# EAGLE design Main_Board (EAGLE 6.3)

## Sheet 1 of 3
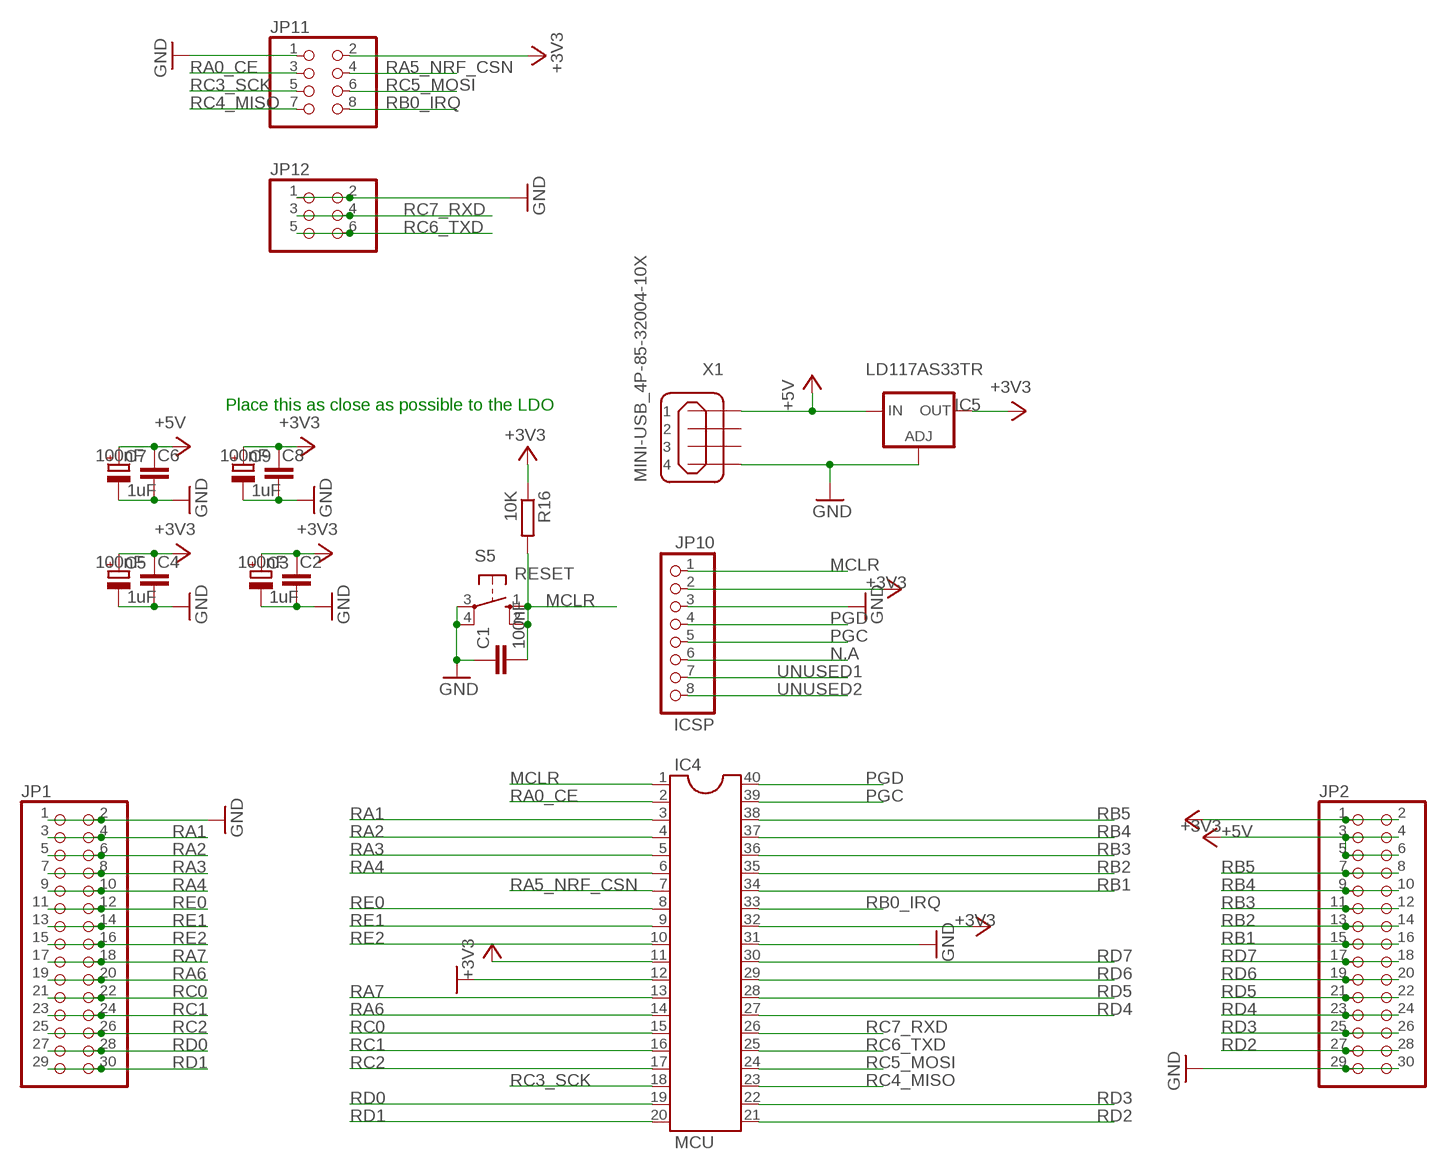
[diagram p0: schematic, sheet 1]

### Parts
C1  100nF  C-EU025-025X050  [C025-025X050]
C2  100nF  C-EU025-025X050  [C025-025X050]
C3  1uF  CPOL-EUE1.8-4  [E1,8-4]
C4  100nF  C-EU025-025X050  [C025-025X050]
C5  1uF  CPOL-EUE1.8-4  [E1,8-4]
C6  100nF  C-EU025-025X050  [C025-025X050]
C7  1uF  CPOL-EUE1.8-4  [E1,8-4]
C8  100nF  C-EU025-025X050  [C025-025X050]
C9  1uF  CPOL-EUE1.8-4  [E1,8-4]
IC4  MCU  DIL40  [DIL40]
IC5  LD117AS33TR  [SOT223]
JP1  PINHD-2X15  [2X15]
JP2  PINHD-2X15  [2X15]
JP10  ICSP  PINHD-1X8  [1X08]
JP11  PINHD-2X4  [2X04]
JP12  PINHD-2X3  [2X03]
R16  10K  R-EU_0207/10  [0207/10]
S5  RESET  10-XX  [B3F-10XX]
X1  MINI-USB_4P-85-32004-10X  [85-32004-10X]

### Nets
+3V3: C2.2 C3.+ C4.2 C5.+ C8.2 C9.+ IC4.11 IC4.32 IC5.4(OUT) JP2.1 JP2.2 JP10.2 JP11.2 R16.1 ; also sheet 2
+5V: C6.2 C7.+ IC5.3(IN) JP2.3 JP2.4 JP2.5 JP2.6 X1.1 ; also sheet 2
GND: C1.1 C2.1 C3.- C4.1 C5.- C6.1 C7.- C8.1 C9.- IC4.12 IC4.31 IC5.1(ADJ) JP1.1 JP1.2 JP2.29 JP2.30 JP10.3 JP11.1 JP12.1 JP12.2 S5.3(P) S5.4(P1) X1.4 ; also sheet 2,3
MCLR: C1.2 IC4.1 JP10.1 R16.2 S5.1(S) S5.2(S1)
N.A: JP10.6
PGC: IC4.39 JP10.5
PGD: IC4.40 JP10.4
RA0_CE: IC4.2 JP11.3
RA1: IC4.3 JP1.3 JP1.4
RA2: IC4.4 JP1.5 JP1.6
RA3: IC4.5 JP1.7 JP1.8
RA4: IC4.6 JP1.9 JP1.10
RA5_NRF_CSN: IC4.7 JP11.4
RA6: IC4.14 JP1.19 JP1.20
RA7: IC4.13 JP1.17 JP1.18
RB0_IRQ: IC4.33 JP11.8
RB1: IC4.34 JP2.15 JP2.16
RB2: IC4.35 JP2.13 JP2.14
RB3: IC4.36 JP2.11 JP2.12
RB4: IC4.37 JP2.9 JP2.10
RB5: IC4.38 JP2.7 JP2.8
RC0: IC4.15 JP1.21 JP1.22
RC1: IC4.16 JP1.23 JP1.24
RC2: IC4.17 JP1.25 JP1.26
RC3_SCK: IC4.18 JP11.5
RC4_MISO: IC4.23 JP11.7
RC5_MOSI: IC4.24 JP11.6
RC6_TXD: IC4.25 JP12.5 JP12.6
RC7_RXD: IC4.26 JP12.3 JP12.4
RD0: IC4.19 JP1.27 JP1.28
RD1: IC4.20 JP1.29 JP1.30
RD2: IC4.21 JP2.27 JP2.28
RD3: IC4.22 JP2.25 JP2.26
RD4: IC4.27 JP2.23 JP2.24
RD5: IC4.28 JP2.21 JP2.22
RD6: IC4.29 JP2.19 JP2.20
RD7: IC4.30 JP2.17 JP2.18
RE0: IC4.8 JP1.11 JP1.12
RE1: IC4.9 JP1.13 JP1.14
RE2: IC4.10 JP1.15 JP1.16
UNUSED1: JP10.7
UNUSED2: JP10.8
Unconnected: X1.2 X1.3

### Notes on the sheet
- Place this as close as possible to the LDO

## Sheet 2 of 3
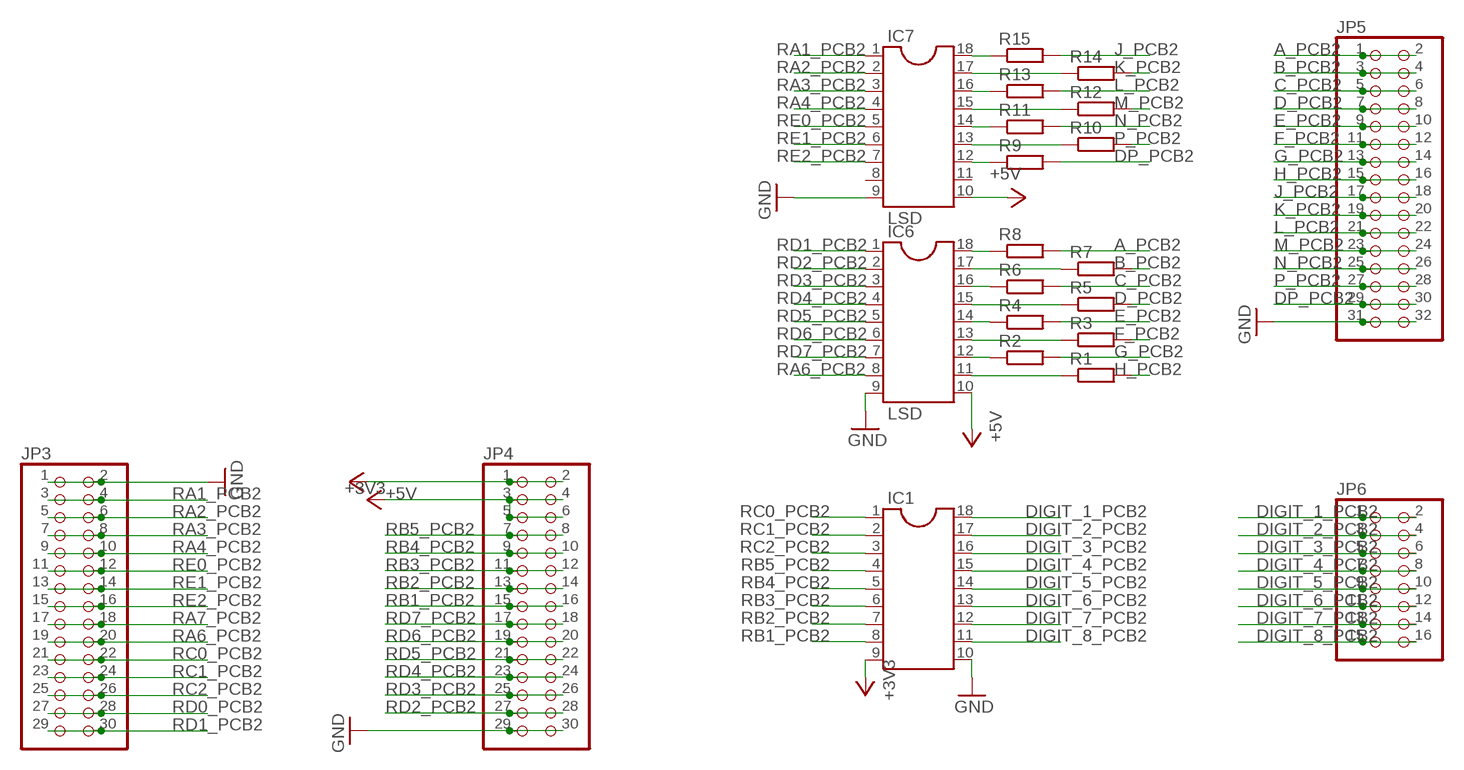
[diagram p1: schematic, sheet 2]

### Parts
IC1  DIL18  [DIL18]
IC6  LSD  DIL18  [DIL18]
IC7  LSD  DIL18  [DIL18]
JP3  PINHD-2X15  [2X15]
JP4  PINHD-2X15  [2X15]
JP5  PINHD-2X16  [2X16]
JP6  PINHD-2X8  [2X08]
R1  R-EU_R0805  [R0805]
R2  R-EU_R0805  [R0805]
R3  R-EU_R0805  [R0805]
R4  R-EU_R0805  [R0805]
R5  R-EU_R0805  [R0805]
R6  R-EU_R0805  [R0805]
R7  R-EU_R0805  [R0805]
R8  R-EU_R0805  [R0805]
R9  R-EU_R0805  [R0805]
R10  R-EU_R0805  [R0805]
R11  R-EU_R0805  [R0805]
R12  R-EU_R0805  [R0805]
R13  R-EU_R0805  [R0805]
R14  R-EU_R0805  [R0805]
R15  R-EU_R0805  [R0805]

### Nets
+3V3: IC1.9 JP4.1 JP4.2 ; also sheet 1
+5V: IC6.10 IC7.10 JP4.3 JP4.4 JP4.5 JP4.6 ; also sheet 1
A_PCB2: JP5.1 JP5.2 R8.2
B_PCB2: JP5.3 JP5.4 R7.2
C_PCB2: JP5.5 JP5.6 R6.2
D_PCB2: JP5.7 JP5.8 R5.2
DIGIT_1_PCB2: IC1.18 JP6.1 JP6.2
DIGIT_2_PCB2: IC1.17 JP6.3 JP6.4
DIGIT_3_PCB2: IC1.16 JP6.5 JP6.6
DIGIT_4_PCB2: IC1.15 JP6.7 JP6.8
DIGIT_5_PCB2: IC1.14 JP6.9 JP6.10
DIGIT_6_PCB2: IC1.13 JP6.11 JP6.12
DIGIT_7_PCB2: IC1.12 JP6.13 JP6.14
DIGIT_8_PCB2: IC1.11 JP6.15 JP6.16
DP_PCB2: JP5.29 JP5.30 R9.2
E_PCB2: JP5.9 JP5.10 R4.2
F_PCB2: JP5.11 JP5.12 R3.2
G_PCB2: JP5.13 JP5.14 R2.2
GND: IC1.10 IC6.9 IC7.9 JP3.1 JP3.2 JP4.29 JP4.30 JP5.31 JP5.32 ; also sheet 1,3
H_PCB2: JP5.15 JP5.16 R1.2
J_PCB2: JP5.17 JP5.18 R15.2
K_PCB2: JP5.19 JP5.20 R14.2
L_PCB2: JP5.21 JP5.22 R13.2
M_PCB2: JP5.23 JP5.24 R12.2
N$16: IC6.18 R8.1
N$17: IC6.17 R7.1
N$18: IC6.16 R6.1
N$19: IC6.15 R5.1
N$20: IC6.14 R4.1
N$21: IC6.13 R3.1
N$22: IC6.12 R2.1
N$23: IC6.11 R1.1
N$24: IC7.18 R15.1
N$25: IC7.17 R14.1
N$26: IC7.16 R13.1
N$27: IC7.15 R12.1
N$28: IC7.14 R11.1
N$29: IC7.13 R10.1
N$30: IC7.12 R9.1
N_PCB2: JP5.25 JP5.26 R11.2
P_PCB2: JP5.27 JP5.28 R10.2
RA1_PCB2: IC7.1 JP3.3 JP3.4
RA2_PCB2: IC7.2 JP3.5 JP3.6
RA3_PCB2: IC7.3 JP3.7 JP3.8
RA4_PCB2: IC7.4 JP3.9 JP3.10
RA6_PCB2: IC6.8 JP3.19 JP3.20
RA7_PCB2: JP3.17 JP3.18
RB1_PCB2: IC1.8 JP4.15 JP4.16
RB2_PCB2: IC1.7 JP4.13 JP4.14
RB3_PCB2: IC1.6 JP4.11 JP4.12
RB4_PCB2: IC1.5 JP4.9 JP4.10
RB5_PCB2: IC1.4 JP4.7 JP4.8
RC0_PCB2: IC1.1 JP3.21 JP3.22
RC1_PCB2: IC1.2 JP3.23 JP3.24
RC2_PCB2: IC1.3 JP3.25 JP3.26
RD0_PCB2: JP3.27 JP3.28
RD1_PCB2: IC6.1 JP3.29 JP3.30
RD2_PCB2: IC6.2 JP4.27 JP4.28
RD3_PCB2: IC6.3 JP4.25 JP4.26
RD4_PCB2: IC6.4 JP4.23 JP4.24
RD5_PCB2: IC6.5 JP4.21 JP4.22
RD6_PCB2: IC6.6 JP4.19 JP4.20
RD7_PCB2: IC6.7 JP4.17 JP4.18
RE0_PCB2: IC7.5 JP3.11 JP3.12
RE1_PCB2: IC7.6 JP3.13 JP3.14
RE2_PCB2: IC7.7 JP3.15 JP3.16
Unconnected: IC7.8 IC7.11

## Sheet 3 of 3
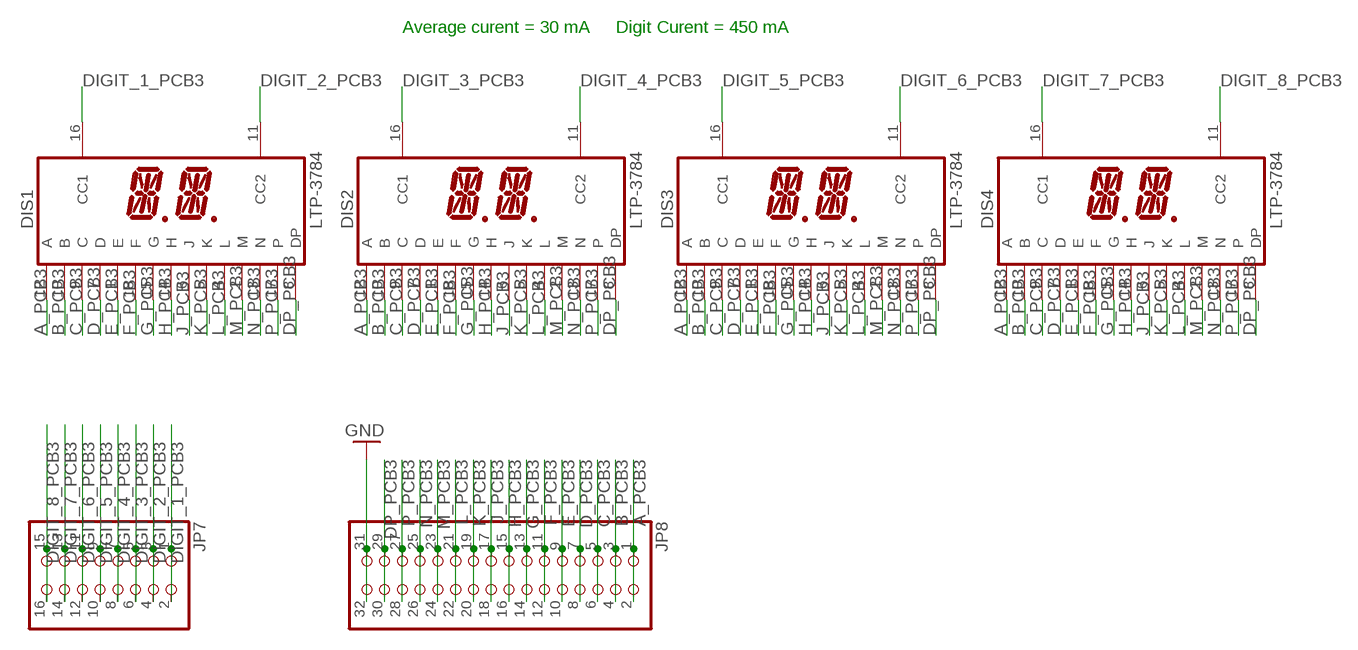
[diagram p2: schematic, sheet 3]

### Parts
DIS1  LTP-3784  [LTP-3784]
DIS2  LTP-3784  [LTP-3784]
DIS3  LTP-3784  [LTP-3784]
DIS4  LTP-3784  [LTP-3784]
JP7  PINHD-2X8  [2X08]
JP8  PINHD-2X16  [2X16]

### Nets
A_PCB3: DIS1.12(A) DIS2.12(A) DIS3.12(A) DIS4.12(A) JP8.1 JP8.2
B_PCB3: DIS1.10(B) DIS2.10(B) DIS3.10(B) DIS4.10(B) JP8.3 JP8.4
C_PCB3: DIS1.9(C) DIS2.9(C) DIS3.9(C) DIS4.9(C) JP8.5 JP8.6
D_PCB3: DIS1.7(D) DIS2.7(D) DIS3.7(D) DIS4.7(D) JP8.7 JP8.8
DIGIT_1_PCB3: DIS1.16(CC1) JP7.1 JP7.2
DIGIT_2_PCB3: DIS1.11(CC2) JP7.3 JP7.4
DIGIT_3_PCB3: DIS2.16(CC1) JP7.5 JP7.6
DIGIT_4_PCB3: DIS2.11(CC2) JP7.7 JP7.8
DIGIT_5_PCB3: DIS3.16(CC1) JP7.9 JP7.10
DIGIT_6_PCB3: DIS3.11(CC2) JP7.11 JP7.12
DIGIT_7_PCB3: DIS4.16(CC1) JP7.13 JP7.14
DIGIT_8_PCB3: DIS4.11(CC2) JP7.15 JP7.16
DP_PCB3: DIS1.8(DP) DIS2.8(DP) DIS3.8(DP) DIS4.8(DP) JP8.29 JP8.30
E_PCB3: DIS1.1(E) DIS2.1(E) DIS3.1(E) DIS4.1(E) JP8.9 JP8.10
F_PCB3: DIS1.18(F) DIS2.18(F) DIS3.18(F) DIS4.18(F) JP8.11 JP8.12
G_PCB3: DIS1.15(G) DIS2.15(G) DIS3.15(G) DIS4.15(G) JP8.13 JP8.14
GND: JP8.31 JP8.32 ; also sheet 1,2
H_PCB3: DIS1.14(H) DIS2.14(H) DIS3.14(H) DIS4.14(H) JP8.15 JP8.16
J_PCB3: DIS1.6(J) DIS2.6(J) DIS3.6(J) DIS4.6(J) JP8.17 JP8.18
K_PCB3: DIS1.5(K) DIS2.5(K) DIS3.5(K) DIS4.5(K) JP8.19 JP8.20
L_PCB3: DIS1.4(L) DIS2.4(L) DIS3.4(L) DIS4.4(L) JP8.21 JP8.22
M_PCB3: DIS1.2(M) DIS2.2(M) DIS3.2(M) DIS4.2(M) JP8.23 JP8.24
N_PCB3: DIS1.13(N) DIS2.13(N) DIS3.13(N) DIS4.13(N) JP8.25 JP8.26
P_PCB3: DIS1.17(P) DIS2.17(P) DIS3.17(P) DIS4.17(P) JP8.27 JP8.28

### Notes on the sheet
- Average curent = 30 mA | Digit Curent = 450 mA

## Library data of the parts
C1 C2 C4 C6 C8 = rcl:C-EU: CAPACITOR, European symbol; SPICEPREFIX: C
C3 C5 C7 C9 = rcl:CPOL-EU: POLARIZED CAPACITOR, European symbol; SPICEPREFIX: C
DIS1-DIS4 = liteon:LTP-3784
IC1 IC6 IC7 = ic-package:DIL18: Dual In Line / Socket
IC4 = ic-package:DIL40: Dual In Line
IC5 = v-reg:LD117A?*: Low drop fixed and adjustable positive voltage regulators 1 A Source: http://www.st.com/stonline/products/literature/ds/7194/ld1117axx.pdf
JP1-JP4 = pinhead:PINHD-2X15: PIN HEADER
JP5 JP8 = pinhead:PINHD-2X16: PIN HEADER
JP6 JP7 = pinhead:PINHD-2X8: PIN HEADER
JP10 = pinhead:PINHD-1X8: PIN HEADER
JP11 = pinhead:PINHD-2X4: PIN HEADER
JP12 = pinhead:PINHD-2X3: PIN HEADER
R1-R16 = rcl:R-EU_: RESISTOR, European symbol
S5 = switch-omron:10-XX: OMRON SWITCH; MPN: B3F-1000; OC_FARNELL: 176432; OC_NEWARK: 36M3542
X1 = con-cypressindustries:MINI-USB_4P-: MINI USB 4 Pol. Source: www.cypressindustries.com; OC_FARNELL: unknown; OC_NEWARK: unknown

## Board
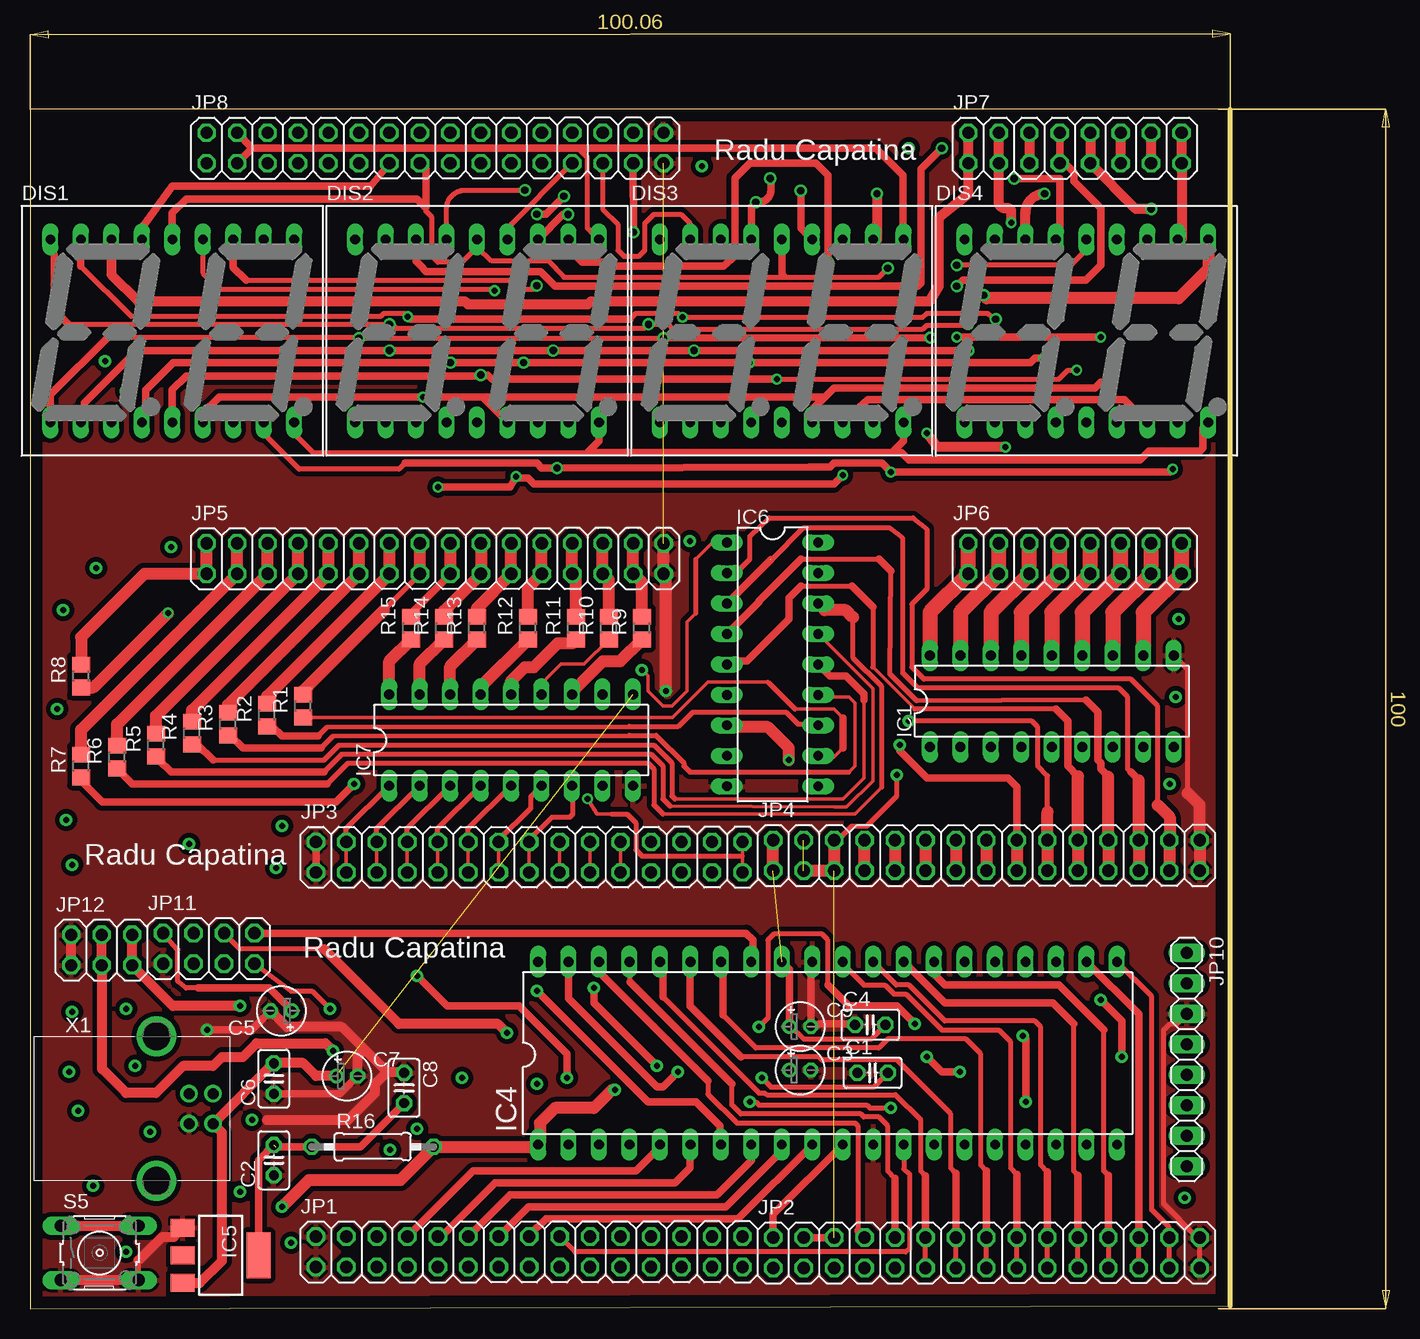
[diagram p3: board, top side]
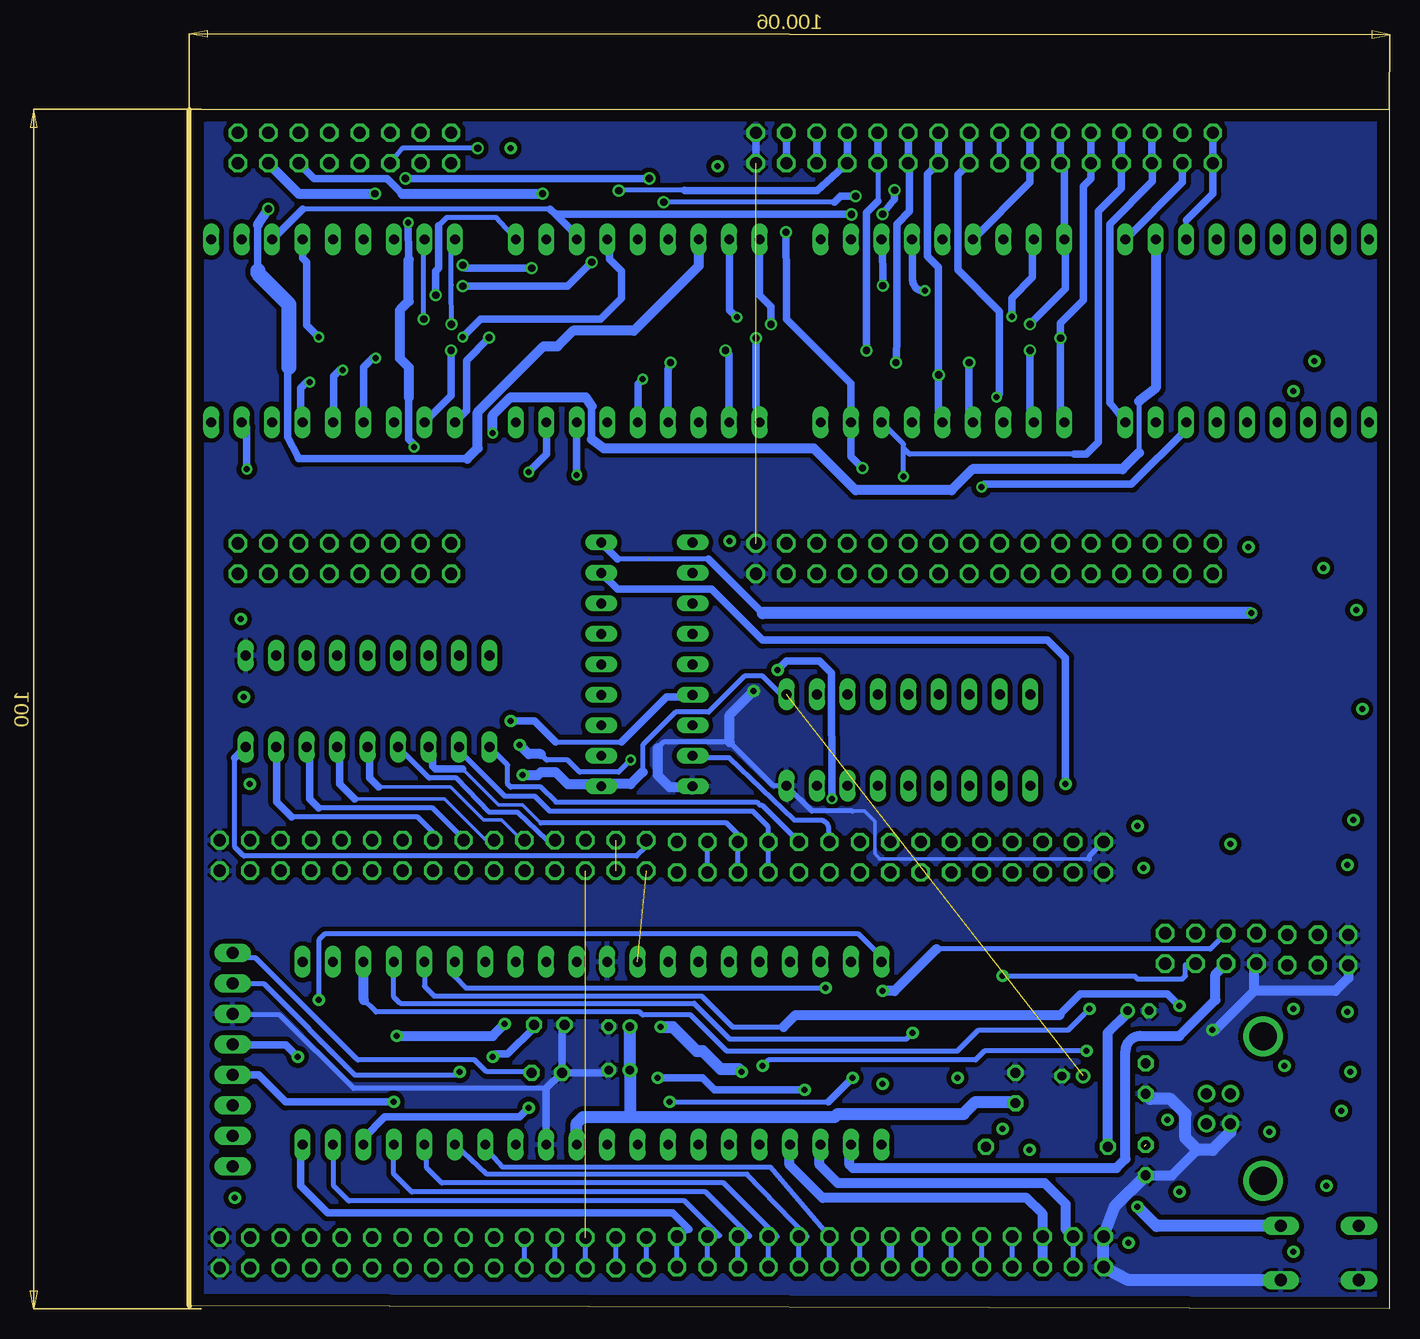
[diagram p4: board, bottom side, seen from below]

Size 100.04 x 100 mm. Coordinates in mm from the lower left corner, seen from the top.
Outline: 0,0 100.04,0.25 100.04,100 0,100 0,0
Copper layers (1*16): Top 0.035mm / dielectric 1.5mm / Bottom 0.035mm
Design rules "default *": minimum track width 10mil, minimum drill 0.24mm, track to track 0.2mm, track to pad 0.2mm, pad to pad 0.2mm, via to via 0.2mm, smd to smd 0.2mm, copper to edge 40mil, drill to drill 8mil, minimum pad ring 10mil, minimum via ring 8mil, stop-mask expansion 4mil, vias tented up to drill 0mil, thermal gap 10mil

### Footprints (pad centres in the part's own frame; a part is rotated, then mirrored left to right if it is on the bottom)
C025-025X050 = drill 0.813 octagon: 1 -1.27,0; 2 1.27,0
E1,8-4 = drill 0.711 pad 1.168: + -0.889,0 | drill 0.711 pad 1.168 octagon: - 0.889,0
LTP-3784 = drill 0.813 long: 1 -10.16,-7.62; 2 -7.62,-7.62; 3 -5.08,-7.62; 4 -2.54,-7.62; 5 0,-7.62; 6 2.54,-7.62; 7 5.08,-7.62; 8 7.62,-7.62; 9 10.16,-7.62; 10 10.16,7.62; 11 7.62,7.62; 12 5.08,7.62; 13 2.54,7.62; 14 0,7.62; 15 -2.54,7.62; 16 -5.08,7.62; 17 -7.62,7.62; 18 -10.16,7.62
DIL18 = drill 0.813 long: 1 -10.16,-3.81; 2 -7.62,-3.81; 3 -5.08,-3.81; 4 -2.54,-3.81; 5 0,-3.81; 6 2.54,-3.81; 7 5.08,-3.81; 8 7.62,-3.81; 9 10.16,-3.81; 10 10.16,3.81; 11 7.62,3.81; 12 5.08,3.81; 13 2.54,3.81; 14 0,3.81; 15 -2.54,3.81; 16 -5.08,3.81; 17 -7.62,3.81; 18 -10.16,3.81
DIL40 = drill 0.813 long: 1 -24.13,-7.62; 2 -21.59,-7.62; 3 -19.05,-7.62; 4 -16.51,-7.62; 5 -13.97,-7.62; 6 -11.43,-7.62; 7 -8.89,-7.62; 8 -6.35,-7.62; 9 -3.81,-7.62; 10 -1.27,-7.62; 11 1.27,-7.62; 12 3.81,-7.62; 13 6.35,-7.62; 14 8.89,-7.62; 15 11.43,-7.62; 16 13.97,-7.62; 17 16.51,-7.62; 18 19.05,-7.62; 19 21.59,-7.62; 20 24.13,-7.62; 21 24.13,7.62; 22 21.59,7.62; 23 19.05,7.62; 24 16.51,7.62; 25 13.97,7.62; 26 11.43,7.62; 27 8.89,7.62; 28 6.35,7.62; 29 3.81,7.62; 30 1.27,7.62; 31 -1.27,7.62; 32 -3.81,7.62; 33 -6.35,7.62; 34 -8.89,7.62; 35 -11.43,7.62; 36 -13.97,7.62; 37 -16.51,7.62; 38 -19.05,7.62; 39 -21.59,7.62; 40 -24.13,7.62
SOT223 = smd 1.5 x 2: 1 -2.3,-3.15; 2 0,-3.15; 3 2.3,-3.15 | smd 3.8 x 2: 4 0,3.15
2X15 = drill 1.016 octagon: 1 -17.78,-1.27; 2 -17.78,1.27; 3 -15.24,-1.27; 4 -15.24,1.27; 5 -12.7,-1.27; 6 -12.7,1.27; 7 -10.16,-1.27; 8 -10.16,1.27; 9 -7.62,-1.27; 10 -7.62,1.27; 11 -5.08,-1.27; 12 -5.08,1.27; 13 -2.54,-1.27; 14 -2.54,1.27; 15 0,-1.27; 16 0,1.27; 17 2.54,-1.27; 18 2.54,1.27; 19 5.08,-1.27; 20 5.08,1.27; 21 7.62,-1.27; 22 7.62,1.27; 23 10.16,-1.27; 24 10.16,1.27; 25 12.7,-1.27; 26 12.7,1.27; 27 15.24,-1.27; 28 15.24,1.27; 29 17.78,-1.27; 30 17.78,1.27
2X16 = drill 1.016 octagon: 1 -19.05,-1.27; 2 -19.05,1.27; 3 -16.51,-1.27; 4 -16.51,1.27; 5 -13.97,-1.27; 6 -13.97,1.27; 7 -11.43,-1.27; 8 -11.43,1.27; 9 -8.89,-1.27; 10 -8.89,1.27; 11 -6.35,-1.27; 12 -6.35,1.27; 13 -3.81,-1.27; 14 -3.81,1.27; 15 -1.27,-1.27; 16 -1.27,1.27; 17 1.27,-1.27; 18 1.27,1.27; 19 3.81,-1.27; 20 3.81,1.27; 21 6.35,-1.27; 22 6.35,1.27; 23 8.89,-1.27; 24 8.89,1.27; 25 11.43,-1.27; 26 11.43,1.27; 27 13.97,-1.27; 28 13.97,1.27; 29 16.51,-1.27; 30 16.51,1.27; 31 19.05,-1.27; 32 19.05,1.27
2X08 = drill 1.016 octagon: 1 -8.89,-1.27; 2 -8.89,1.27; 3 -6.35,-1.27; 4 -6.35,1.27; 5 -3.81,-1.27; 6 -3.81,1.27; 7 -1.27,-1.27; 8 -1.27,1.27; 9 1.27,-1.27; 10 1.27,1.27; 11 3.81,-1.27; 12 3.81,1.27; 13 6.35,-1.27; 14 6.35,1.27; 15 8.89,-1.27; 16 8.89,1.27
1X08 = drill 1.016 long: 1 -8.89,0; 2 -6.35,0; 3 -3.81,0; 4 -1.27,0; 5 1.27,0; 6 3.81,0; 7 6.35,0; 8 8.89,0
2X04 = drill 1.016 octagon: 1 -3.81,-1.27; 2 -3.81,1.27; 3 -1.27,-1.27; 4 -1.27,1.27; 5 1.27,-1.27; 6 1.27,1.27; 7 3.81,-1.27; 8 3.81,1.27
2X03 = drill 1.016 octagon: 1 -2.54,-1.27; 2 -2.54,1.27; 3 0,-1.27; 4 0,1.27; 5 2.54,-1.27; 6 2.54,1.27
R0805 = smd 1.3 x 1.5: 1 -0.95,0; 2 0.95,0
0207/10 = drill 0.813 octagon: 1 -5.08,0; 2 5.08,0
B3F-10XX = drill 1.016 long: 1 -3.251,2.261; 2 3.251,2.261; 3 -3.251,-2.261; 4 3.251,-2.261
85-32004-10X = drill 0.92 pad 1.27: 1 4.71,-1.25; 2 4.71,1.25; 3 2.71,1.25; 4 2.71,-1.25 | drill 2.3 pad 3: M1 0,6.02; M2 0,-6.02

### Placement (x,y rotation side)
C1  70.24,19.68 0 top
C2  20.32,12.39 90 top
C3  64.2,19.91 0 top
C4  70.04,23.68 0 top
C5  20.94,24.84 180 top
C6  20.32,19.19 90 top
C7  26.42,19.41 0 top
C8  31.18,18.41 270 top
C9  64.2,23.53 0 top
DIS1  11.86,81.53 0 top
DIS2  37.26,81.53 0 top
DIS3  62.66,81.53 0 top
DIS4  88.06,81.53 0 top
IC1  85.18,50.65 0 top
IC4  66.48,21.31 0 top
IC5  15.89,4.46 270 top
IC6  61.9,53.72 270 top
IC7  40.1,47.41 0 top
JP1  41.61,4.75 0 top
JP2  79.73,4.67 0 top
JP3  41.61,37.65 0 top
JP4  79.73,37.79 0 top
JP5  33.77,62.54 0 top
JP6  87.11,62.54 0 top
JP7  87.11,96.77 0 top
JP8  33.77,96.77 0 top
JP10  96.43,20.77 270 top
JP11  14.9,30.04 0 top
JP12  5.97,29.91 0 top
R1  22.75,50.25 90 top
R2  19.75,49.5 90 top
R3  16.5,48.75 90 top
R4  13.5,48 90 top
R5  10.5,47 90 top
R6  7.25,46 90 top
R7  4.25,45.25 90 top
R8  4.25,52.75 90 top
R9  51,56.75 90 top
R10  48.25,56.75 90 top
R11  45.5,56.75 90 top
R12  41.5,56.75 90 top
R13  37.25,56.75 90 top
R14  34.5,56.75 90 top
R15  31.75,56.75 90 top
R16  28.56,13.51 0 top
S5  5.8,4.66 0 top
X1  10.54,16.69 0 top

### Tracks (layer width: path | path; a pad name or v marks a point on that pad's centre or on a via)
+3V3  (via drill 0.5 pad 1.02)  (2 unrouted)
  Top 0.406: C9.+ 63.31,23.69 64.5,22.5 70.13,22.5 C4.2 | 14,26.75 13,26.75 12.33,27.28 12.33,29.93 JP11.2
  Top 0.61: 21.9,24.91 C5.+ 19.92,26.75 14,26.75 | 63.31,23.69 63.31,28.29 IC4.32 | 20.47,13.51 R16.1 27.55,13.51 C8.2 | IC5.4 19.04,12.38 C2.2 | JP2.2 61.95,7.89 IC4.11 | v77.5,19.75 76,19.75 v74.75,21
  Top 1.016: JP4.1 JP4.2
  Bottom 0.406: JP4.2 61.95,38.55 62.75,37.75 95.5,37.75 96.25,38.5 96.25,45.93 | JP2.1 JP2.2 | C5.+ 21.83,24.67 | 23.5,13.53 R16.1 | JP10.2 93.87,27.12 86.25,19.5 77.75,19.5 v77.5,19.75
  Bottom 0.61: 96.25,45.93 IC1.9 | C4.2 71.31,23.44 73.5,21.25 74.5,21.25 v74.75,21
  Bottom 0.813: 21.83,24.67 23.5,23 23.5,13.53
  Bottom 1.016: IC4.11 67.75,15.47 67.22,16 63.25,16 | C9.+ C3.+ 63.31,16.06 63.25,16 | 63.25,16 46.25,16 46,16.25 35.5,16.25 34.5,17.25 31.29,17.25 C8.2
+5V  (via drill 0.5 pad 1.02)  (3 unrouted)
  Top 0.406: JP4.6 67.31,39.06 68.5,40.25 69.75,40.25 72.25,42.75 v72.25,44.5
  Top 0.61: JP2.6 JP2.4 | 20.36,20.5 C6.2 20.27,20.46
  Top 0.813: IC5.3 14.16,2.16 16,4 16,14.69 X1.1 20.27,20.46 | C7.+ 23.84,19.41 22.75,20.5 20.36,20.5
  Top 1.016: JP4.6 JP4.5 JP4.3
  Bottom 0.305: IC7.10 50.72,51.22
  Bottom 0.406: 50.72,51.22 52.25,52.75 53.75,52.75 56.75,49.75 59.5,49.75 62.25,47 62.25,44.75 | 71,44.5 70.75,44.75 | JP2.3 JP2.4 | JP2.5 JP2.6
  Bottom 0.813: 62.25,44.75 63.25,43.75 65.52,43.75 IC6.10 65.9,43.75 68.5,43.75 69.5,44.75 70.75,44.75 | v72.25,44.5 71,44.5
A_PCB2
  Top 1.016: R8.2 4.25,56 9.52,61.27 JP5.1 JP5.2
A_PCB3  (via drill 0.6, 0.61)
  Top 0.406: 18,85.75 40.5,85.75 41.25,85 41.95,85 v42.24,85.29
  Top 0.61: DIS1.12 16.94,86.81 18,85.75 | v44.85,91.24 44.43,91.24 DIS2.12
  Bottom 0.406: DIS1.12 16.94,90.74 | 69.97,91.69 90.6,91.69 | DIS3.12 67.74,89.47 | 42.25,89.06 DIS2.12
  Bottom 0.61: 16.94,90.74 14.72,92.96 JP8.1 JP8.2 | v44.85,91.24 69.51,91.24 | 90.6,91.69 DIS4.12 | 69.51,91.24 69.97,91.69 | 67.74,89.47 69.51,91.24 | v42.24,85.29 42.25,89.06
B_PCB2
  Top 1.016: R7.2 4.25,48.26 JP5.3 JP5.4
B_PCB3  (via drill 0.6)
  Top 0.406: 45.2,96.77 45.69,96.77 46.45,96.02 46.45,90.13 DIS2.10
  Top 0.61: JP8.3 18.53,96.77 | 18.53,96.77 45.2,96.77 68.06,96.77 68.08,96.75 70.5,96.75 72.75,94.5 72.75,89.22 DIS3.10 | 18.53,96.77 JP8.4 | 79.75,84.25 v79.5,84.5 | 98.25,87.69 98.22,87.72
  Top 1.016: DIS4.10 98.22,87.72 | 79.75,84.25 95.75,84.25 98.25,86.75 98.25,87.69
  Bottom 0.406: DIS3.10 74.5,90.98 78.58,90.98 79.25,90.31
  Bottom 0.61: JP8.3 17.26,93.91 DIS1.10 | v79.5,84.5 79.5,86.5 79.25,86.75 79.25,90.31
C_PCB2
  Top 1.016: R6.2 7.25,48.72 JP5.5 JP5.6
C_PCB3
  Top 0.406: DIS1.9 22.02,72.96 23.61,71.37 46.47,71.37
  Top 0.61: 71.87,71.37 46.47,71.37 47.42,72.32 DIS2.9 | DIS3.9 72.82,72.32 71.87,71.37 | 71.87,71.37 72.63,71.37 73.25,70.75 92.5,70.75 93.25,71.5 97.5,71.5 97.75,71.75 97.75,73.44 DIS4.9
  Bottom 0.61: JP8.6 JP8.5 19.75,95.45 19.75,94 23.32,90.43 23.32,75.56 DIS1.9
D_PCB2
  Top 1.016: R5.2 10.5,49.43 JP5.7 JP5.8
D_PCB3  (via drill 0.5)
  Top 0.406: DIS1.7 17.26,74.23 17.26,74.55 | 40.62,69.5 v40.51,69.39
  Top 0.61: DIS4.7 91.23,75.81 69.83,75.81 DIS3.7 | v34,68.5 40,68.5 v40.51,69.39 40.65,69.25 41.5,69.25 42,68.75 67,68.75 v67.75,69.5
  Bottom 0.406: DIS1.7 16.94,73.31 | 33.75,68.75 v34,68.5 | v40.51,69.39 40.5,71.75 | 40.5,71.75 40.5,72.07 DIS2.7 | 26.25,71.25 40,71.25 40.5,71.75 | DIS3.7
  Bottom 0.61: JP8.8 JP8.7 22.34,93.41 24.25,91.5 24.25,72.25 25.25,71.25 26.25,71.25 | 33.75,68.75 21.5,68.75 16.94,73.31 | v67.75,69.5 DIS3.7
DIGIT_1_PCB2
  Top 1.27: IC1.18 75.02,58.07 JP6.1 JP6.2
DIGIT_1_PCB3
  Top 0.813: JP7.2 JP7.1 78.22,92.96 75.75,90.99 75.75,85.25 75,84 46.75,84 46.5,83.75 36.5,83.75 36.25,84 9,84 6.78,86.22 DIS1.16
DIGIT_2_PCB2
  Top 1.27: IC1.17 77.56,58.07 JP6.3 JP6.4
DIGIT_2_PCB3  (via drill 0.5)
  Top 0.813: JP7.4 JP7.3 arc90 JP7.3 80.75,92.25 arc90 81.25,91.75 81.5,91.75 arc-90 81.79,91.46 v81.79,90.54 | v81.32,71.85 75.65,71.85 v74.75,73
  Bottom 0.406: 20.88,75.66 20.88,71.37 | v81.32,71.85 81.32,72.07
  Bottom 0.61: v81.79,90.54 81.75,87.5 | 66.5,75.25 66.5,72.5 | 81.32,72.07 81.75,72.5 81.75,76
  Bottom 0.813: DIS1.11 19.48,76.77 20.88,75.66 | 20.88,71.37 22.25,70 34.75,70 36.5,68.25 44.5,68.25 48,71.75 65.5,71.75 66.5,72.5 | v74.75,73 74.75,74.5 73.25,76 67,76 66.5,75.25 | 81.75,87.5 81.75,84 82.5,83.25 82.5,79.25 81.75,78.5 81.75,76
DIGIT_3_PCB2
  Top 1.27: IC1.16 80.1,58.07 JP6.5 JP6.6
DIGIT_3_PCB3  (via drill 0.6)
  Top 0.406: 32.5,87 32.5,86.99
  Top 0.61: DIS2.16 32.18,87.32 32.5,87 | 32.5,86.99 33.03,86.46 42.54,86.46 43.75,85.25 74,85.25 74.25,85.5 74.25,95 v76,96.75
  Top 0.813: JP7.6 JP7.5
  Bottom 0.406: v76,96.75 82.3,96.75 JP7.5
DIGIT_4_PCB2
  Top 1.27: IC1.15 82.64,58.07 JP6.7 JP6.8
DIGIT_4_PCB3  (via drill 0.6)
  Top 0.61: DIS2.11 44.88,88.37 46,87.25 48,87.25 48.57,86.93 57.82,86.93 58.75,87.75 58.75,94.25 60,95.5 65.5,95.5 66.5,94.5 v66.5,87.25 | JP7.8 JP7.7 86.25,95.5 87,94.75 87,94 89.25,91.75 89.25,87 88,85.75 77.75,85.75 v77.25,85.25
  Bottom 0.61: v77.25,85.25 68.5,85.25 v66.5,87.25
DIGIT_5_PCB2
  Top 1.27: IC1.14 85.18,58.07 JP6.9 JP6.10
DIGIT_5_PCB3  (via drill 0.6)
  Top 0.813: JP7.10 JP7.9 92.19,91.69 v93.46,91.69
  Bottom 0.61: 90.92,70.87 90.99,71.01 | 90.99,71.01 91.84,72.66 91.84,78.41 91.75,78.5 | 94.34,86.55 94.34,90.36 | 76.88,70.87 90.85,70.87 90.99,71.01
  Bottom 0.813: DIS3.16 57.58,86.93 62.98,81.53 68.06,81.53 69.34,80.25 70.5,80.25 76,74.75 76,71.75 76.88,70.87 | 94.34,90.36 v93.46,91.69
  Bottom 1.27: 94.34,86.55 94.34,86.34 91.75,83.75 91.75,78.5
DIGIT_6_PCB2
  Top 1.27: IC1.13 87.72,58.07 JP6.11 JP6.12
DIGIT_6_PCB3  (via drill 0.61)
  Top 0.813: v70.6,92.96 70.6,89.15 DIS3.11 | JP7.11 JP7.12
  Bottom 0.61: 82.3,92.96 83.57,94.23 89.65,94.23 JP7.11
  Bottom 0.813: 82.3,92.96 v70.6,92.96
DIGIT_7_PCB2
  Top 1.27: IC1.12 90.26,58.07 JP6.13 JP6.14
DIGIT_7_PCB3  (via drill 0.61)
  Top 0.813: JP7.13 JP7.14 | DIS4.16 82.98,91.37 arc-90 v84.57,92.96
  Bottom 0.813: v84.57,92.96 90.92,92.96 JP7.13
DIGIT_8_PCB2
  Top 1.27: IC1.11 92.8,58.07 JP6.15 JP6.16
DIGIT_8_PCB3
  Top 0.254: 96,89.15 DIS4.11
  Top 0.813: 96,89.15 JP7.15 JP7.16
DP_PCB2
  Top 1.016: R9.2 51,60.55 JP5.29 JP5.30
DP_PCB3  (via drill 0.5, 0.6)
  Top 0.406: DIS1.8 19.8,73.59 19.8,72.64 22.44,70 30.75,70 31.25,70.5
  Top 0.61: v50.3,89.74 JP8.29 | 31.25,70.5 42.25,70.5 42.65,70.1 v43.93,70.1 64.97,70.17 66.67,70.17 67,70.5 71,70.5 v71.75,69.75 95,69.75 v95.25,70
  Bottom 0.406: 70.25,73.88 DIS3.8
  Bottom 0.61: v43.93,70.1 44.88,71.05 DIS2.8 44.88,77.13 50.25,82.5 50.25,85.31 50.28,85.34 v50.3,89.74 | JP8.29 JP8.30 | 70.25,73.88 70.25,71.25 v71.75,69.75 | v95.25,70 95.25,73.48 DIS4.8
E_PCB2
  Top 1.016: R4.2 13.5,49.89 JP5.9 JP5.10
E_PCB3  (via drill 0.6)
  Top 0.406: v52.82,80.92 v27.42,80.92 27.34,81 6.5,81
  Top 0.61: v52.82,80.92 v75.07,80.95 | DIS1.1 1.7,76.2 6.5,81
  Bottom 0.406: DIS2.1 27.42,74.23
  Bottom 0.61: 27.42,74.23 v27.42,80.92 27.42,82.17 25.52,84.07 25.52,93.59 24.88,94.23 JP8.9 JP8.10 | DIS3.1 52.5,74.86 52.82,75.18 v52.82,80.92 | v75.07,80.95 76.95,79.03 76.95,74.86 DIS4.1
F_PCB2
  Top 1.016: R3.2 16.5,50.35 JP5.11 JP5.12
F_PCB3  (via drill 0.6)
  Top 0.406: 3.18,82.07 v29.96,82.07 30.18,82.07 30.5,81.75 51.23,81.75 v51.55,82.07 53.18,82.07 53.58,81.67 74.42,81.67 74.75,82 78.13,82 v78.2,82.07 | 2,87.9 1.7,88.2
  Top 0.61: DIS1.18 1.7,88.2 | 3.18,82.07 2,83.25 2,87.9
  Bottom 0.406: v78.2,82.07 78.22,85.34 78.22,88.83 DIS4.18 | v29.96,82.07 29.68,82.07 | 27,89.05 DIS2.18
  Bottom 0.61: DIS2.18 27.1,95.18 JP8.11 JP8.12 | v51.55,82.07 51.55,83.55 52.5,84.5 DIS3.18 | 27,89.05 27,85.03 v29.96,82.07
G_PCB2
  Top 1.016: R2.2 19.75,51.06 JP5.13 JP5.14
G_PCB3  (via drill 0.6, 0.61)
  Top 0.406: DIS1.15 9.32,90.1 | DIS2.15 34.72,91.72 arc-90 36.25,93.25 v41.25,93.25
  Top 0.61: 9.32,90.1 11.86,93.59 28.37,93.59 JP8.13 | v82.03,94.23 85.84,94.23 85.84,89.15 DIS4.15 | v42.25,91.25 43,91.25 v44.5,92.75 | DIS3.15 60.12,91.87 v60.5,92.25 60.75,92.25 arc90 61.75,93.25 61.75,94.19 arc90 v61.71,94.23
  Bottom 0.406: 46.25,92.25 v60.5,92.25
  Bottom 0.61: DIS2.15 29.96,93.91 JP8.13 JP8.14 | v82.03,94.23 v61.71,94.23 | v41.25,93.25 41.25,92.5 v42.25,91.25 | v44.5,92.75 45.75,92.75 46.25,92.25
GND  (via drill 0.5 pad 1.02)  (1 unrouted)
  Top 0.305: 53,61.09 JP5.31
  Top 0.406: 96.5,43 96.5,53.3 IC1.10 | JP2.29 JP2.30 97.31,5.94 94.5,8.75 94.5,23.25 95,23.75 95.6,23.75 JP10.3 | S5.4 9.05,4.05 | 65.09,28.81 IC4.31 | 68.7,23.75 C4.1
  Top 0.61: JP3.1 JP3.2 | C6.1 25.82,17.92 C7.- | 20.05,24.7 C5.- 18.46,23.25 v14.75,23.25 | 31.11,19.75 C8.1 | 65.09,28.81 C9.- 65.53,23.53 65.75,23.75 68.7,23.75
  Top 0.813: IC5.1 11.98,6 11,6 9.05,4.05 | C7.- 27.31,21.06 27.88,21.62 | 27.88,21.62 29.75,19.75 | 29.75,19.75 31.11,19.75 | S5.4 S5.3 | 19.75,15.75 26.5,15.75 28.75,18 28.75,18.75 29.75,19.75 | 27.88,21.62 26,23.5 21.39,23.5 C5.- | JP12.1 JP12.2
  Top 1.016: JP4.29 JP4.30 97.51,41.99 96.5,43 | v53,51.5 53,61.09 | JP5.31 JP5.32
  Bottom 0.305: 58.15,43.5 IC6.9 | 25,37.5 42.5,37.5 42.9,37.97 42.9,40.65 43.75,41.5 44.75,41.5
  Bottom 0.406: 44.75,41.5 48.16,41.5 IC7.9 51.35,43.6 55,47.25 60.5,47.25 61,46.75 | 68.97,23.48 C4.1 | C6.1 20.32,17.82 | 70.29,18.36 86.36,18.36 92.5,24.5 96.35,24.5 JP10.3 | 25,37.5 25,37.75 JP3.2
  Bottom 0.61: JP8.31 JP8.32 | IC4.12 70.29,18.36 C1.1 | C1.1 68.97,23.48 | C1.1 65.32,19.68 C3.-
  Bottom 0.813: 61,46.75 61,44.5 60,43.5 58.15,43.5 | 55,47.25 55,49.5 v53,51.5 | C2.1 18.13,11.12 16,13.25 | v14.75,23.25 14.5,23.25 11.25,26.5 | 11.25,26.5 11.25,28.61 JP11.1 | JP12.1 3.43,27.57 4.5,26.5 11.25,26.5
  Bottom 1.016: C2.1 22.83,8.61 JP1.2 JP1.1 21.75,2.4 S5.4 | X1.4 13.25,14.75 14.75,13.25 16,13.25 17,14.25 17,16.25 18.25,17.5 19.9,17.5 C6.1
  pour Top (isolate 0.406): 0,100 100,100 100,0.25 0,0
  pour Bottom (isolate 0.406): 0,0 100,0.25 100,100 0,100
H_PCB2
  Top 0.406: R1.2 22.75,51.52 | 29.5,58.25 32.5,61.25 JP5.15
  Top 1.016: 22.75,51.52 29.5,58.25 | JP5.15 JP5.16
H_PCB3  (via drill 0.6)
  Top 0.406: DIS4.14 88.06,88.31 86.75,87 v77.25,87 | DIS2.14 37.26,88.49 38.44,87.39 43.19,87.39 44.5,86 63,86 | 63,86 70.75,86 v71.5,86.75 | 37.26,88.51 36,87.25 34,87.25 33.5,87.75 33.5,91 33,91.5 33,91.88 32.88,91.88 | 62.66,86.34 63,86
  Top 0.61: DIS1.14 11.86,91.36 13,92.5 32.25,92.5 32.88,91.88 | DIS2.14 37.26,88.51 | DIS3.14 62.66,86.34 | JP8.15 33,95 33,91.88
  Bottom 0.406: JP8.15 JP8.16
  Bottom 0.61: v71.5,86.75 77,86.75 v77.25,87
J_PCB2
  Top 0.305: R15.2 31.75,57.98
  Top 0.61: 31.75,57.98 JP5.17
  Top 1.016: JP5.17 JP5.18
J_PCB3  (via drill 0.5)
  Top 0.406: DIS3.6 65.2,74.95
  Top 0.61: v90,77.25 89.25,77.25 88.75,76.75 67,76.75 66.5,76.25 | 65.2,74.95 66.5,76.25 | DIS1.6 14.4,74.65 15.75,76 v32.75,76 37.71,76 | 37.71,76 DIS2.6 | 37.71,76 66.25,76 66.5,76.25
  Bottom 0.406: v90,77.25 90.25,77.25
  Bottom 0.61: JP8.18 JP8.17 35.99,94.55 35.99,86.61 32.5,83.12 32.5,76.83 32.5,76.25 v32.75,76 | 90.25,77.25 90.75,76.75 90.75,74.06 DIS4.6
K_PCB2
  Top 0.305: R14.2 34.5,58.19
  Top 1.016: 34.5,58.19 JP5.19 JP5.20
K_PCB3  (via drill 0.5, 0.6)
  Top 0.406: v87.25,78.25 86.5,78.25 85.75,77.5 v62.25,77.5
  Top 0.61: v62.25,77.5 38.5,77.5 38.15,77.86 v37.58,77.86 37.48,77.75 13,77.75 11.86,76.61 DIS1.5
  Bottom 0.406: DIS2.5 37.58,74.23 | v87.25,78.25 87.5,78.25 | 88,73.97 DIS4.5
  Bottom 0.61: 37.58,74.23 v37.58,77.86 37.58,86.61 37.58,86.83 38.5,87.75 38.5,94.58 JP8.19 JP8.20 | 87.5,78.25 88,77.75 88,73.97 | DIS3.5 62.66,77.09 v62.25,77.5
L_PCB2
  Top 0.305: R13.2 37.25,58.4
  Top 1.016: 37.25,58.4 JP5.21 JP5.22
L_PCB3  (via drill 0.5, 0.6)
  Top 0.406: DIS1.4 9.64,74.23
  Top 0.61: 9.64,74.23 9.64,76.58 11.93,78.88 v35.04,78.88 v41.14,78.88 v59.94,78.88 83.38,78.88 83.75,79.25 v84.5,79.25
  Bottom 0.406: DIS2.4 35.04,74.23 | 40,95.38 JP8.21
  Bottom 0.61: 35.04,74.23 v35.04,78.88 | DIS3.4 60.12,78.31 v59.94,78.88 | v41.14,78.88 41.07,80.58 41.07,83.75 41.06,85.2 41.06,90.44 40,91.5 40,95.38 | JP8.21 JP8.22 | v84.5,79.25 84.75,79.25 85.5,78.5 85.5,73.93 DIS4.4
M_PCB2
  Top 1.016: R12.2 41.5,60.11 JP5.23 JP5.24
M_PCB3  (via drill 0.6)
  Top 0.61: v78.22,79.89 v55.36,79.89 v43.61,79.89 v29.96,79.89 8.89,79.89 4.5,75.5 4.5,74.17 DIS1.2
  Bottom 0.406: DIS2.2 29.96,74.23 | JP8.23 42.66,92.33 | 55.04,79.58 v55.36,79.89
  Bottom 0.61: 29.96,74.23 v29.96,79.89 | v78.22,79.89 78.22,76.13 DIS4.2 | 42.66,92.33 43.61,91.37 v43.61,79.89 | JP8.23 JP8.24 | DIS3.2 55.04,79.58
MCLR  (via drill 0.5 pad 1.02)
  Top 0.406: v61,19.25 61.75,18.5 70.33,18.5 C1.2 | 42.5,13.84 IC4.1
  Top 0.61: 42.17,13.51 IC4.1
  Top 0.813: S5.1 S5.2
  Top 1.016: 42.17,13.51 R16.2 30.88,10.75 23.25,10.75 v21,8.5 | v48.75,18.25 48.5,18.25 47,16.75 43.75,16.75 42.5,15.5 42.5,13.84
  Bottom 0.406: C1.2 71.51,19.76 75.26,19.76 76.25,20.75 86,20.75 94.5,29.25 96.02,29.25 JP10.1
  Bottom 0.61: v61,19.25 57.25,19.25 56.25,18.25 v48.75,18.25
  Bottom 1.016: S5.2 19.42,6.92 v21,8.5
N$1  (via drill 0.5 pad 1.02)
  other vias: 8,4.75
N$2  (via drill 0.5 pad 1.02)
  other vias: 5.25,10.25
N$3  (via drill 0.5 pad 1.02)
  other vias: 4,16.5
N$4  (via drill 0.5 pad 1.02)
  other vias: 10,14.75
N$5  (via drill 0.5 pad 1.02)
  other vias: 3.5,24.75
N$6  (via drill 0.5 pad 1.02)
  other vias: 3.25,19.75
N$7  (via drill 0.5 pad 1.02)
  other vias: 8,25
N$8  (via drill 0.5 pad 1.02)
  other vias: 8.75,20.25
N$9  (via drill 0.5 pad 1.02)
  other vias: 18.5,15.75
N$10  (via drill 0.5 pad 1.02)
  other vias: 17.5,9.75
N$11  (via drill 0.5 pad 1.02)
  other vias: 21.75,5.5
N$12  (via drill 0.5 pad 1.02)
  other vias: 96.25,9.25
N$13  (via drill 0.5 pad 1.02)
  other vias: 36,19.25
N$14  (via drill 0.5 pad 1.02)
  other vias: 42.25,18.75
N$15  (via drill 0.5 pad 1.02)
  other vias: 32.25,15
N$16  (via drill 0.5)
  Top 1.016: R8.1 5.3,51.8 v11.5,58
  Bottom 0.406: 56.75,62.5 64.33,62.5
  Bottom 0.61: 52.25,58 56.75,62.5 | 64.33,62.5 IC6.18
  Bottom 1.016: v11.5,58 52.25,58
N$17  (via drill 0.5 pad 1.02)
  Top 0.305: R7.1 4.25,44
  Top 0.61: 4.25,44 6,42.25 25.5,42.25 v27,43.75
  Bottom 0.61: v27,43.75 27,54.25 28.5,55.75 52.25,55.75 56.5,60 64.37,60 IC6.17
N$18
  Top 0.305: R6.1 7.25,45 | 52.75,41.25 68.75,41.25 71,43.5
  Top 0.406: 24.75,43.75 26.5,45.5 51.5,45.5 52,45 52,42 52.75,41.25 | 71,43.5 71,51.87 68.61,54.27 68.61,57.64
  Top 0.61: 7.25,45 8.5,43.75 24.75,43.75
  Top 1.016: 68.61,57.64 68,58.25 66.26,58.25 IC6.16
N$19
  Top 0.305: R5.1 10.7,46.05 10.7,45.8 | 53.36,41.9 67.06,41.82 68.07,41.82 70.25,44 70.25,51.72 IC6.15
  Top 0.406: 24.5,44.75 26,46.25 51.75,46.25 52.75,45.25 52.75,42.5 53.36,41.9
  Top 0.61: 10.7,45.8 11.75,44.75 24.5,44.75
N$20
  Top 0.305: R4.1 13.95,47.05 | 53.75,42.5 67.75,42.5 69.5,44.25 69.5,50.75
  Top 0.406: 15.25,45.75 24.5,45.75 25.75,47 52,47 53.5,45.5 53.5,42.75 53.75,42.5
  Top 0.61: 13.95,47.05 15.25,45.75 | 69.5,50.75 69.5,51.25 68,52.75 66.68,52.75 IC6.14
N$21
  Top 0.305: R3.1 16.7,47.8 | 68.25,44.75 68.75,45.25 68.75,50.5 68.25,51 65.89,51 IC6.13
  Top 0.406: 24.25,46.75 25.25,47.75 49.95,47.8 52.2,47.8 54.5,45.5 54.5,45.25 55,44.75 68.25,44.75
  Top 0.61: 16.7,47.8 17.75,46.75 24.25,46.75
N$22
  Top 0.305: R2.1 20.2,48.55 | 65.6,48.75 IC6.12
  Top 0.406: 24,47.75 24.75,48.5 49.95,48.55 54.05,48.55 55.25,49.75 63,49.75 64,48.75 65.6,48.75
  Top 0.61: 20.2,48.55 21,47.75 24,47.75
N$23
  Top 0.305: R1.1 53.55,49.3 56.5,52.25 61.5,52.25 | 67.75,49.25 67,50 63.75,50 | 67.75,46.75 67,46 65.81,46 IC6.11
  Top 0.406: 61.5,52.25 63.75,50
  Top 0.61: 67.75,49.25 67.75,46.75
N$24
  Top 1.016: IC7.18 29.94,53.99 R15.1
N$25
  Top 1.016: IC7.17 32.48,53.78 R14.1
N$26
  Top 1.016: IC7.16 35.02,53.57 R13.1
N$27
  Top 1.016: IC7.15 37.56,51.86 R12.1
N$28
  Top 0.305: 45.2,55.5 R11.1
  Top 1.016: IC7.14 40.1,52.35 41.25,53.5 42,53.5 44,55.5 45.2,55.5
N$29
  Top 0.305: IC7.13 42.64,52.14 44.25,53.75 46.2,53.75 R10.1
N$30
  Top 0.305: IC7.12 45.22,51.47
  Top 1.016: 45.22,51.47 47.75,54 49.2,54 R9.1
N$31  (via drill 0.5 pad 1.02)
  other vias: 30,13.25
N$34  (via drill 0.5 pad 1.02)
  other vias: 2.75,58.25
N$35  (via drill 0.5 pad 1.02)
  other vias: 5.5,61.75
N$36  (via drill 0.5 pad 1.02)
  other vias: 11.75,63.5
N$37  (via drill 0.5 pad 1.02)
  other vias: 2.25,50
N$38  (via drill 0.5 pad 1.02)
  other vias: 3,40.75
N$39  (via drill 0.5 pad 1.02)
  other vias: 21,40.25
N$40  (via drill 0.5 pad 1.02)
  other vias: 20.5,36.75
N$41  (via drill 0.5 pad 1.02)
  other vias: 3.5,37
N$42  (via drill 0.5 pad 1.02)
  other vias: 13.25,38.75
N$43  (via drill 0.5 pad 1.02)
  other vias: 95.75,57.5
N$44  (via drill 0.5 pad 1.02)
  other vias: 55,64
N$46  (via drill 0.5 pad 1.02)
  other vias: 95.5,51
N$47  (via drill 0.5 pad 1.02)
  other vias: 95,43.75
N$48  (via drill 0.5 pad 1.02)
  other vias: 8,76.5
N$49  (via drill 0.5 pad 1.02)
  other vias: 6.25,79
N$50  (via drill 0.5 pad 1.02)
  other vias: 73.25,96.75
N$51  (via drill 0.5 pad 1.02)
  other vias: 56,95.25
N_PCB2
  Top 1.016: R11.2 45.5,60.97 JP5.25 JP5.26
N_PCB3  (via drill 0.5, 0.61)
  Top 0.406: JP8.25 39.8,90.1 DIS2.13 39.75,89.1 | DIS1.13 14.4,86.35 15.75,85 38.61,85 v38.73,84.88
  Top 0.61: v64.25,93.21 64.25,90.1 DIS3.13 | v77.25,81 v89.25,81
  Bottom 0.406: 65,88.95 DIS3.13 | 58.75,93.25 64.21,93.25 v64.25,93.21 | v38.73,84.88 38.88,84.88 | 39.75,89.1 DIS2.13 arc90 39.75,89.1
  Bottom 0.61: JP8.26 JP8.25 47.74,93.21 58.71,93.21 58.75,93.25 | DIS4.13 90.6,87.6 90.25,87.25 90.25,82 v89.25,81 | v77.25,81 75.75,82.5 65.75,82.5 64,84.25 64,86.5 65,87.5 65,88.95 | DIS2.13 arc90 39.75,89.1 39.75,85.75 arc-90 38.88,84.88
P_PCB2
  Top 1.016: R10.2 48.25,60.76 JP5.27 JP5.28
P_PCB3  (via drill 0.5, 0.6)
  Top 0.406: JP8.27 47.74,91.69 49.01,90.42 49.01,88.24 49.5,87.75 50.75,87.75 51.25,88.25 51.25,90.5 52,91.25 54.25,91.25 55,90.5 55,89.19 DIS3.17 | 79.75,83 79.92,82.89 | 79.92,82.89 v80.5,82.5 | 50,82.5 50.5,83 54.03,83 v54.38,82.65 74.4,82.65 74.75,83 79.81,83 79.92,82.89 | v31.49,82.72 31.21,83 29.5,83 29.25,82.75 8.42,82.75 4.24,86.93
  Top 0.61: DIS1.17 4.24,86.93 | 50,82.5 31.71,82.5 v31.49,82.72
  Bottom 0.406: v80.5,82.5 80.5,89.09 DIS4.17 | 55,89.11 DIS3.17
  Bottom 0.61: JP8.28 JP8.27 | 55,89.11 55,83.27 v54.38,82.65 | v31.49,82.72 31.49,84.26 29.75,86 29.75,89.04 DIS2.17
PGC  (via drill 0.5 pad 1.02)
  Top 0.406: 66.5,27 66.5,30.75 66,31.25 62,31.25 61.5,30.75 61.5,24.25 v60.75,23.5
  Top 0.61: v83,17.25 83,22.5 v82.75,22.75 | v73.75,23.75 72.25,25.25 68.25,25.25 66.5,27 | IC4.39 44.89,25.86 52.25,18.5 52.75,18.5 v54,19.75
  Bottom 0.61: v83,17.25 92,17.25 94.25,19.5 JP10.5 | 54.25,20 v54,19.75
  Bottom 0.813: v82.75,22.75 74.75,22.75 v73.75,23.75
  Bottom 1.016: v60.75,23.5 59.75,23.5 57.75,21.5 57.25,21.5 55.75,20 54.25,20
PGD  (via drill 0.5 pad 1.02)
  Top 0.61: v89.25,25.75 91,24 v91,21
  Bottom 0.406: IC4.40 42.35,29.35 44.25,31.25 88.75,31.25 89.25,30.75 v89.25,25.75 | 96.39,22 JP10.4
  Bottom 0.61: 96.39,22 92,22 v91,21
RA0_CE
  Bottom 0.406: 44.75,11.75 45,12 | 45,13.58 IC4.2
  Bottom 0.813: 44.75,11.75 22.75,11.75 22,12.5 22,21.5 arc90 20.75,22.75 17.5,22.75 14.5,25.75 14.5,27.9 JP11.3 | 45,12 45,13.58
RA1
  Bottom 0.406: JP1.3 JP1.4 | 47.5,13.62 IC4.3
  Bottom 0.813: 47.5,13.62 47.5,12 46,10.5 28.75,10.5 27,8.75 27,6.65 JP1.4
RA1_PCB2
  Top 0.305: JP3.4 JP3.3
  Top 0.406: JP3.4 26.37,40.03 IC7.1
RA2
  Bottom 0.406: 50,13.66 IC4.4
  Bottom 0.813: JP1.5 JP1.6 28.91,7.91 30.25,9.25 47.25,9.25 50,12 50,13.66
RA2_PCB2
  Top 0.305: JP3.6 JP3.5
  Top 0.406: JP3.6 28.91,40.03 IC7.2
RA3
  Top 0.61: IC4.5 52.51,13.51 50.5,11.5 36.93,11.5 JP1.8
  Bottom 0.406: JP1.7 JP1.8
RA3_PCB2
  Top 0.305: JP3.8 JP3.7
  Top 0.406: JP3.8 31.45,40.03 IC7.3
RA4
  Top 0.61: JP1.10 34.27,6.02 38.75,10.5 53.75,10.5 55,11.75 55,13.64 IC4.6
  Bottom 0.406: JP1.9 JP1.10
RA4_PCB2
  Top 0.305: JP3.10 JP3.9
  Top 0.406: JP3.10 33.99,40.03 IC7.4
RA5_NRF_CSN  (via drill 0.5 pad 1.02)
  Top 0.406: 57.5,13.78 IC4.7
  Top 0.61: 57.5,13.78 57.5,15.25 55.5,17.25 51.5,17.25 v42.25,26.5
  Bottom 0.406: 37.75,30 14.94,30 JP11.4
  Bottom 0.813: 37.75,30 41.25,26.5 v42.25,26.5
RA6
  Bottom 0.406: JP1.19 JP1.20 51.64,11.83 73.97,11.83 75.37,13.37 IC4.14
RA6_PCB2
  Top 0.305: JP3.20 JP3.19
  Bottom 0.305: 57.92,45.94 IC6.8
  Bottom 0.406: 57.92,45.94 55.06,45.94 49.62,40.75 47.5,40.75 arc90 46.75,40 46.75,38.98 arc-90 JP3.20
RA7
  Top 0.406: IC4.13 72.83,11.67 73.32,11.24 73.32,4.99 73,4.75 45.42,4.75 JP1.18
  Bottom 0.406: JP1.17 JP1.18
RA7_PCB2
  Top 0.305: JP3.18 JP3.17
RB0_IRQ
  Top 0.406: 60.25,29.05 IC4.33
  Top 0.61: JP11.8 59.69,31.31 60.25,30.75 60.25,29.05
RB1
  Top 0.406: JP2.15 JP2.16 | 79.73,11.52 79.25,12 79.25,21.25 78,22.5 71.5,22.5 70.75,21.75 60.5,21.75 57.75,24.5 | 57.75,28.77 IC4.34
  Top 0.61: JP2.16 79.73,11.52 | 57.75,24.5 57.75,28.77
RB1_PCB2
  Top 1.016: JP4.16 JP4.15
  Bottom 0.305: 92.75,46.79 IC1.8
  Bottom 0.406: JP4.16 79.73,39.73 81,41 91.5,41
  Bottom 0.61: 91.5,41 92.75,42.25 92.75,46.79
RB2
  Top 0.406: JP2.13 JP2.14 | 77.19,11.31 76.75,11.75 76.75,16.25 72.25,20.75 66,20.75 65.75,21 59.25,21 | 55,28.88 IC4.35
  Top 0.61: JP2.14 77.19,11.31 | 59.25,21 55,25.25 55,28.88
RB2_PCB2
  Top 1.016: JP4.14 JP4.13
  Bottom 0.305: JP4.14 77.19,39.19
  Bottom 0.406: 77.19,39.19 79.75,41.75 89.25,41.75
  Bottom 0.61: 89.25,41.75 90,42.5 90,46.58 IC1.7
RB3
  Top 0.406: JP2.11 JP2.12 | 74.65,11.1 74.25,11.5 74.25,15.75 72.15,17.85 61.41,17.85 61.26,18 60.75,18 52.75,26 | 52.75,28.69 IC4.36
  Top 0.61: JP2.12 74.65,11.1 | 52.75,26 52.75,28.69
RB3_PCB2
  Top 1.016: JP4.12 JP4.11
  Bottom 0.305: JP4.12 74.65,39.15 75.4,39.15 78.75,42.5 86.25,42.5
  Bottom 0.406: 87.5,46.62 IC1.6
  Bottom 0.61: 86.25,42.5 87.5,43.75 87.5,46.62
RB4
  Top 0.406: 72.11,10.89 71.5,11.5 71.5,15.25 70.75,16 69.5,16 69.25,16.25 59.25,16.25 58.5,17 58.5,18.75 | 50,27.25 50,28.9 IC4.37
  Top 0.61: JP2.10 72.11,10.89 | 58.5,18.75 50,27.25
  Bottom 0.406: JP2.9 JP2.10
RB4_PCB2
  Top 1.016: JP4.10 JP4.9
  Bottom 0.305: JP4.10 72.31,39.06 74,40.75 75.5,40.75 78.25,43.5 84.25,43.5
  Bottom 0.406: 85,46.66 IC1.5
  Bottom 0.61: 85,46.66 85,44.25 84.25,43.5
RB5
  Top 0.406: 47.5,28 47.5,28.86 IC4.38 | 56.5,19 56.5,17.9 58.91,15.48 68.77,15.48 69,15.25 69,6.51
  Top 0.61: 47.5,28 56.5,19 | 69,6.51 JP2.8
  Bottom 0.406: JP2.7 JP2.8
RB5_PCB2
  Top 1.016: JP4.7 JP4.8
  Bottom 0.305: JP4.8 70.23,39.06
  Bottom 0.406: IC1.4 80.05,44.25 77.75,44.25 75.03,41.4 72.69,41.4 70.23,39.06
RC0
  Bottom 0.406: JP1.21 JP1.22 48.52,6.02 53.54,11.22 75.26,11.22 IC4.15
RC0_PCB2
  Top 0.305: JP3.21 JP3.22
  Bottom 0.406: IC1.1 73.5,45.32 73.5,43.75 73.25,43.5 70.75,43.5 69.49,42.24 52.74,42.24 52.5,42 52.31,42 JP3.22
RC1
  Bottom 0.406: JP1.23 JP1.24 51.02,6.02 55.5,10.5 79,10.5 80.25,11.75 80.25,13.49 IC4.16
RC1_PCB2
  Bottom 0.305: IC1.2 77.56,46.56
  Bottom 0.406: 77.56,46.56 73.75,42.75 71.25,42.75 70,41.5 53.1,41.5 51.77,40.17 JP3.24 JP3.23
RC2
  Bottom 0.406: JP1.25 JP1.26 53.31,6.06 57,9.75 81.5,9.75 83,11.25 IC4.17
RC2_PCB2
  Bottom 0.305: 70.75,40.5 72.25,42 74.25,42 77.25,45
  Bottom 0.406: 70.75,40.5 55.25,40.5 54.31,39.56 JP3.26 JP3.25
  Bottom 0.61: 77.25,45 79.5,45 79.75,45.25 79.75,46.49 IC1.3
RC3_SCK  (via drill 0.5 pad 1.02)
  Top 0.406: v71.75,16.75 70,16.75 69.75,17 60.75,17 60.5,17.25 v60,17.25
  Top 0.61: v44.75,19.25 44.75,21.25 40.75,25.25 34.75,25.25 v32.25,27.75
  Bottom 0.406: IC4.18 85.53,14.22 | v60,17.25 46.75,17.25 | v32.25,27.75 21.25,27.75 21,27.5 17.25,27.5 17,27.75 17,28.69 JP11.5
  Bottom 0.61: 85.53,14.22 83.75,16 72.5,16 v71.75,16.75 | 46.75,17.25 v44.75,19.25
RC4_MISO  (via drill 0.5 pad 1.02)
  Top 0.406: JP11.7 21.73,26.5 23.5,26.5 v25,25
  Bottom 0.406: 85.5,25.75 84.55,24.82 84.48,24.75 62.5,24.75 62.25,24.5 58.25,24.5 55.25,21.5 36,21.5 34.25,23.25 26.75,23.25 v25,25 | 85.5,28.9 IC4.23
  Bottom 0.813: 85.5,25.75 85.5,28.9
RC5_MOSI  (via drill 0.5 pad 1.02)
  Top 0.406: 24.5,30 17.48,30 JP11.6
  Top 0.813: v39.75,23 39,23.75 30.75,23.75 24.5,30
  Bottom 0.406: IC4.24 83,26 82.47,25.48 57.98,25.48 55,22.5 40.25,22.5 v39.75,23
RC6_TXD  (via drill 0.5 pad 1.02)
  Top 0.813: v17.5,25.25 11.9,25.25 JP12.5 JP12.6
  Bottom 0.406: IC4.25 80.45,26.88 79.65,26.08 57.33,26.08 54.75,23.5 50.5,23.5
  Bottom 0.61: 27.5,24.5 25.75,26.25 18.5,26.25 v17.5,25.25
  Bottom 0.813: 50.5,23.5 49.5,24.5 27.5,24.5
RC7_RXD  (via drill 0.5 pad 1.02)
  Top 0.61: v47,26.75 47,25.5 v52.25,20.25
  Top 0.813: v25.25,21.5 24.62,22.13 18.88,22.13 17.75,21 16,21 15.25,20.25 12.75,20.25 10.5,18 8,18 6,20 6,28.61 JP12.3 JP12.4
  Bottom 0.406: IC4.26 77.91,27.66 77,26.75 v47,26.75 | v25.25,21.5 33.75,21.5 34.5,20.75 51.75,20.75 v52.25,20.25
RD0
  Bottom 0.406: JP1.27 JP1.28 55.85,6.1 58.75,9 86.75,9 88,10.25 88,13.62 IC4.19
RD0_PCB2
  Bottom 0.406: JP3.27 JP3.28
RD1
  Bottom 0.406: JP1.29 JP1.30 58.39,6.64 | 90.75,13.55 IC4.20
  Bottom 0.61: 58.39,6.64 59.75,8 88.5,8 90.75,10.25 90.75,13.55
RD1_PCB2  (via drill 0.5, 0.5 pad 1.02)
  Top 0.305: JP3.29 59.39,37.75 JP3.30 | 48.5,41.25 47.25,41.25 v46.46,42.52 | v51,53.25 51.5,52.75 51.5,51.5 52.75,50.25 53.5,50.25 54.75,51.5 54.75,57.25 55.5,58 | 55.5,62.5 56.75,63.75 57.96,63.75 IC6.1
  Top 0.406: 55.5,58 55.5,62.5 | 48.5,41.25 49.75,41.25 50.5,40.5 50.5,38.25 51,37.75 59.39,37.75
  Bottom 0.61: v46.46,42.52 46.5,53 47.5,54 50.25,54 v51,53.25
RD2
  Top 0.406: JP2.27 JP2.28 94.97,6.78 93.5,8.25 93.5,26.04 IC4.21
RD2_PCB2
  Top 0.305: IC6.2 58.84,61.34 | 95,39.09 JP4.28
  Top 0.406: 58.84,61.34 60,62.5 60,64.4 61.61,65.93 73.61,65.93 74.75,65 74.75,60 73.5,58.75 73.5,53.5 74.5,52.5 91.75,52.5 94,50.25 94,42
  Top 1.016: JP4.28 JP4.27 | 94,42 95,41 95,39.09
RD3
  Top 0.406: JP2.25 JP2.26
  Top 0.61: JP2.26 92.43,24.57 IC4.22
RD3_PCB2  (1 unrouted)
  Top 0.406: 61.75,62.5 61.88,62.5 64.45,65.07 71.7,65.07 72.75,64.25 72.75,53 74,51.75 90.75,51.75 91.5,51 91.5,45 91.75,44.75
  Top 0.61: 92.43,44.07 91.75,44.75 | 61.75,62.46 IC6.3
  Top 1.016: JP4.25 JP4.26 92.43,44.07
RD4
  Top 0.406: 89.89,11.11 89.5,11.5 89.5,23.25 | JP2.24 JP2.23
  Top 0.61: JP2.24 89.89,11.11 | 89.5,23.25 85.75,27 76.25,27 75.5,27.75 75.5,28.8 IC4.27
RD4_PCB2
  Top 0.406: 88,50.75 73.93,50.69 71.68,52.94 71.75,61.5 | 64.25,62.5 70.75,62.5
  Top 0.61: 89.89,44.36 89.25,45 89.25,45.5 89,45.75 89,49.75 88,50.75 | IC6.4 60.75,58.92 60.75,59 64.25,62.5 | 70.75,62.5 71.75,61.5
  Top 1.016: JP4.23 JP4.24 89.89,44.36
RD5
  Top 0.406: JP2.21 JP2.22 | 87.35,11.15 87,11.5 87,23.75
  Top 0.61: JP2.22 87.35,11.15 | 87,23.75 85.25,25.5 76.25,25.5 73.33,28.42 73.33,28.43 IC4.28
RD5_PCB2
  Top 0.305: 73.75,50 70.25,53.5
  Top 0.406: 85.5,50 73.75,50 | 64.25,60.25 68.5,60.25 | 70.25,58.5 70.25,53.5
  Top 0.61: 87.35,44.4 86.5,45.25 86.5,49 85.5,50 | IC6.5 58.37,54 59.75,54 63.25,57.5 63.25,59.25 64.25,60.25 | 68.5,60.25 70.25,58.5
  Top 1.016: JP4.21 JP4.22 87.35,44.4
RD6
  Top 0.406: JP2.19 JP2.20 | 84.81,11.44 84.25,12 84.25,23.5 83.75,24 76.25,24 73.25,27 72.22,27 IC4.29
  Top 0.61: JP2.20 84.81,11.44
RD6_PCB2  (via drill 0.5 pad 1.02)
  Top 0.406: 84.81,41.44 84.81,44.44 84,45.25 84,48.5 83.5,49 v73.25,49
  Top 1.016: JP4.19 JP4.20 84.81,41.44
  Bottom 0.406: 69.5,47.25 64,47.25
  Bottom 0.61: 64,47.25 60.25,51 58.27,51 IC6.6 | 69.5,47.25 71.25,49 v73.25,49
RD7
  Top 0.406: JP2.17 JP2.18 | 82.27,11.23 81.75,11.75 81.75,22.25 81.62,22.38 81.5,22.5 80.75,23.25 76,23.25 73,26.25 72,26.25 71.25,27 69.5,27 67.75,28.75 IC4.30
  Top 0.61: JP2.18 82.27,11.23
RD7_PCB2  (via drill 0.5, 0.5 pad 1.02)
  Top 0.61: v72.5,47 72.5,46.5 74.75,44.25 81.5,44.25 82.25,43.5 82.25,39.08
  Top 1.016: JP4.17 JP4.18 82.25,39.08 | v63.25,45.75 63.25,46.75 61.5,48.5 58.23,48.5 IC6.7
  Bottom 0.406: v63.25,45.75 64.25,44.75 67.5,44.75 68.5,45.75 70.25,45.75 70.75,46.25
  Bottom 0.813: 70.75,46.25 71.75,46.25 v72.5,47
RE0
  Top 0.61: IC4.8 60.13,12.38 57.25,9.5 40.01,9.5 JP1.12
  Bottom 0.406: JP1.11 JP1.12
RE0_PCB2
  Top 0.305: JP3.12 JP3.11
  Top 0.406: JP3.12 36.53,40.03 IC7.5
RE1
  Top 0.61: IC4.9 62.67,13.17 58,8.5 41.55,8.5 JP1.14
  Bottom 0.406: JP1.13 JP1.14
RE1_PCB2
  Top 0.305: JP3.14 JP3.13
  Top 0.406: JP3.14 39.07,39.07 41.75,41.75 41.75,42.71 IC7.6
RE2
  Top 0.61: IC4.10 59.02,7.5 43,7.5 41.61,6.11 JP1.16
  Bottom 0.61: JP1.15 JP1.16
RE2_PCB2
  Top 0.305: JP3.16 JP3.15
  Top 0.406: JP3.16 41.61,39.11 43.5,41 45,41 45.25,41.25 45.25,43.53 IC7.7

### Text on the board
tNames: Radu Capatina | Radu Capatina | Radu Capatina